# Altium schematic sheet master.SchDoc
size A4; SheetNumber: 1; SheetTotal: 1
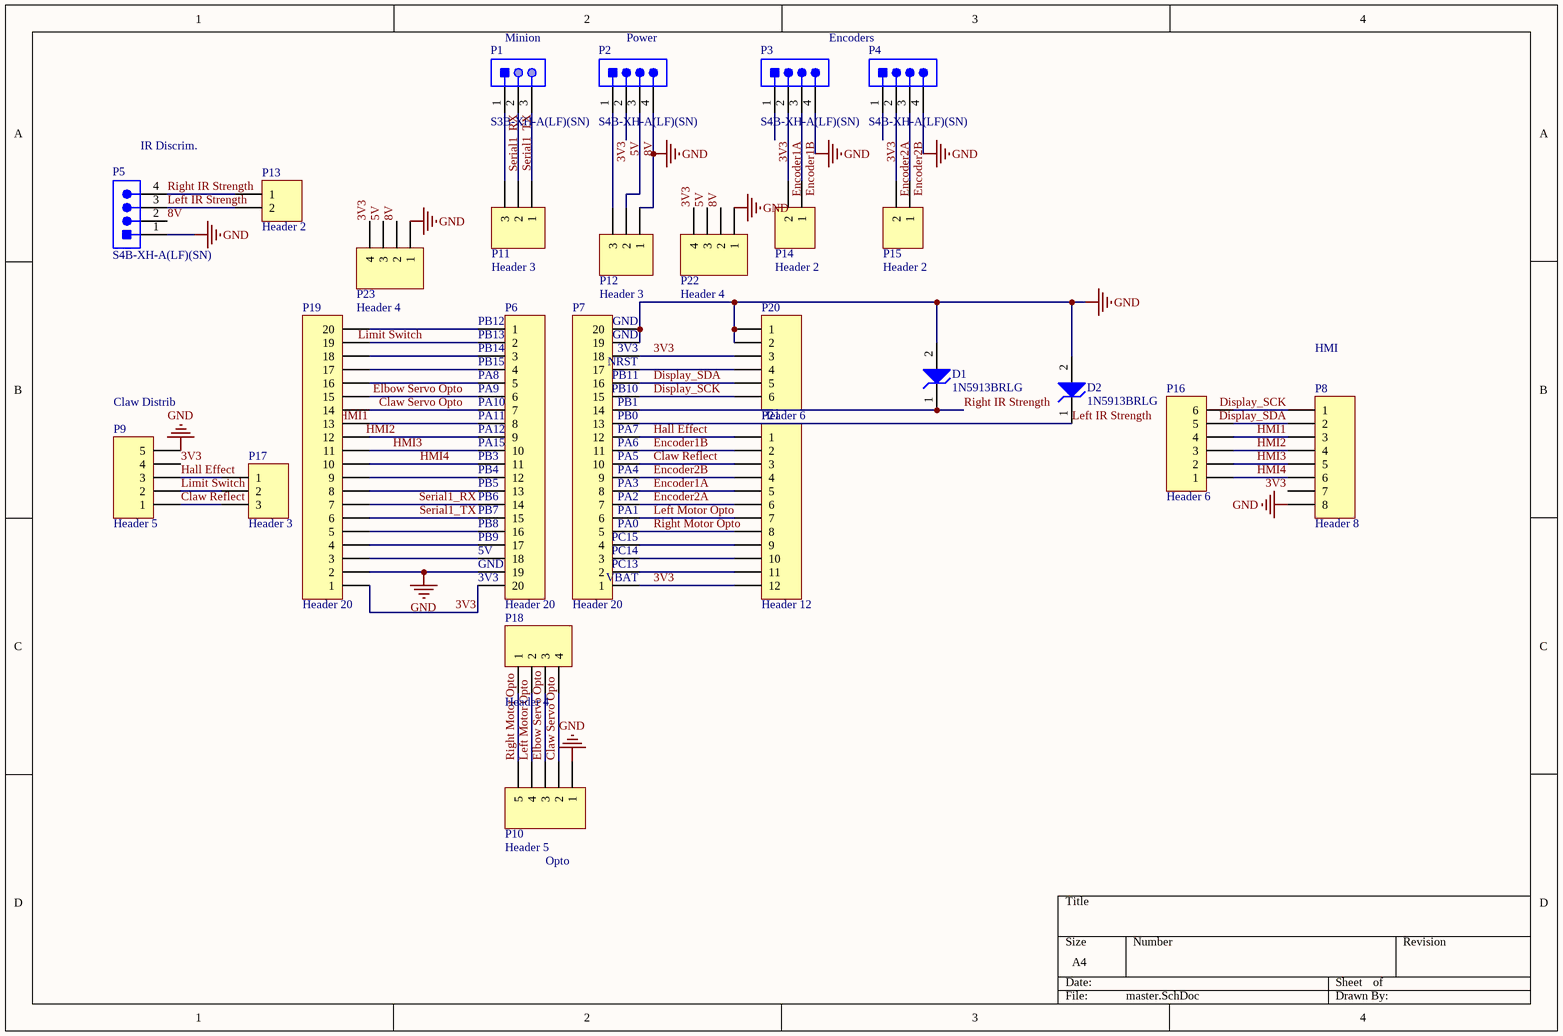
[diagram p0: master.SchDoc]

## Parts
D1  1N5913BRLG  [ONSC-AXIAL_LEAD-2-59-10_P]
D2  1N5913BRLG  [ONSC-AXIAL_LEAD-2-59-10_P]
P1  S3B-XH-A(LF)(SN)  [JST-S3B-XH-A(LF)(SN)_V]
P2  S4B-XH-A(LF)(SN)  [JST-S4B-XH-A(LF)(SN)_V]
P3  S4B-XH-A(LF)(SN)  [JST-S4B-XH-A(LF)(SN)_V]
P4  S4B-XH-A(LF)(SN)  [JST-S4B-XH-A(LF)(SN)_V]
P5  S4B-XH-A(LF)(SN)  [JST-S4B-XH-A(LF)(SN)_V]
P6  Header 20  [HDR1X20]
P7  Header 20  [HDR1X20]
P8  Header 8  [HDR1X8]
P9  Header 5  [HDR1X5]
P10  Header 5  [HDR1X5]
P11  Header 3  [HDR1X3]
P12  Header 3  [HDR1X3]
P13  Header 2  [HDR1X2]
P14  Header 2  [HDR1X2]
P15  Header 2  [HDR1X2]
P16  Header 6  [HDR1X6]
P17  Header 3  [HDR1X3]
P18  Header 4  [HDR1X4]
P19  Header 20  [HDR1X20]
P20  Header 6  [HDR1X6]
P21  Header 12  [HDR1X12]
P22  Header 4  [HDR1X4]
P23  Header 4  [HDR1X4]

## Nets
GND: D1.2(A) D2.2(A) P2.4 P3.4 P4.4 P5.1 P6.19 P7.19 P7.20 P8.8 P9.5 P10.1 P12.1 P19.2 P20.1 P20.2 P22.1 P23.1
3V3: P2.1 P3.1 P4.1 P6.20 P7.1 P7.18 P8.7 P9.4 P12.3 P19.1 P20.3 P21.12 P22.4 P23.4
5V: P2.2 P22.3 P23.3
8V: P2.3 P5.2 P12.2 P22.2 P23.2
Claw Reflect: P7.10 P9.1 P17.3 P21.3
Claw Servo Opto: P6.7 P10.2 P18.4 P19.14
Display_SCK: P7.15 P8.1 P16.6 P20.6
Display_SDA: P7.16 P8.2 P16.5 P20.5
Elbow Servo Opto: P6.6 P10.3 P18.3 P19.15
Encoder1A: P3.2 P7.8 P14.2 P21.5
Encoder1B: P3.3 P7.11 P14.1 P21.2
Encoder2A: P4.2 P7.7 P15.2 P21.6
Encoder2B: P4.3 P7.9 P15.1 P21.4
Hall Effect: P7.12 P9.3 P17.1 P21.1
HMI1: P6.8 P8.3 P16.4 P19.13
HMI2: P6.9 P8.4 P16.3 P19.12
HMI3: P6.10 P8.5 P16.2 P19.11
HMI4: P6.11 P8.6 P16.1 P19.10
Left IR Strength: D2.1(K) P5.3 P7.13 P13.2
Left Motor Opto: P7.6 P10.4 P18.2 P21.7
Limit Switch: P6.2 P9.2 P17.2 P19.19
Right IR Strength: D1.1(K) P5.4 P7.14 P13.1
Right Motor Opto: P7.5 P10.5 P18.1 P21.8
Serial1_RX: P1.1 P6.14 P11.3 P19.7
Serial1_TX: P1.2 P6.15 P11.2 P19.6
NetP1_3: P1.3 P11.1
NetP6_1: P6.1 P19.20
NetP6_3: P6.3 P19.18
NetP6_4: P6.4 P19.17
NetP6_5: P6.5 P19.16
NetP6_12: P6.12 P19.9
NetP6_13: P6.13 P19.8
NetP6_16: P6.16 P19.5
NetP6_17: P6.17 P19.4
NetP6_18: P6.18 P19.3
NetP7_2: P7.2 P21.11
NetP7_3: P7.3 P21.10
NetP7_4: P7.4 P21.9
NetP7_17: P7.17 P20.4

## Notes on the sheet
- (near P1) Minion
- (near P2) Power
- Encoders
- (near P5) IR Discrim.
- (near P6) PB12
- (near P6) PB13
- (near P6) PB14
- (near P6) PB15
- (near P6) PA8
- (near P7) PB11
- (near P7) NRST
- (near P7) GND
- (near P7) 3V3
- HMI
- (near P9) Claw Distrib
- (near P6) PA9
- (near P6) PA10
- (near P6) PA11
- (near P6) PA12
- (near P6) PA15
- (near P7) PA6
- (near P7) PA7
- (near P7) PB0
- (near P7) PB1
- (near P7) PB10
- (near P6) PB3
- (near P6) PB4
- (near P6) PB5
- (near P6) PB7
- (near P6) PB6
- (near P7) PA1
- (near P7) PA2
- (near P7) PA3
- (near P7) PA5
- (near P7) PA4
- (near P6) PB8
- (near P6) PB9
- (near P6) 5V
- (near P6) GND
- (near P6) 3V3
- (near P7) PC14
- (near P7) PC13
- (near P7) VBAT
- (near P7) PC15
- (near P7) PA0
- Opto

## Library data of the parts
D1 D2 = CMP-1060-00006-1: 3 W Zener Voltage Regulator, 2-Pin Axial_Lead, Pb-Free, Tape and Reel; Manufacturer: On Semiconductor; VZ Typ (V): 3.3; ComponentLink1URL: http://www.onsemi.com/; PartNumber: 1N5913BRLG; RoHS: Pb-Free; ComponentLink3URL: http://www.onsemi.cn/pub_link/Collateral/59-10.PDF; ComponentLink2Description: Datasheet; ComponentLink2URL: http://www.onsemi.cn/pub_link/Collateral/1N5913B-D.PDF; DatasheetVersion: Rev. 5; Packing: Tape and Reel; PackageReference: AXIAL_LEAD-2-59-10; ComponentLink3Description: Package Specification; PackageDescription: 2-Pin, Axial Lead, Diameter 2.35 mm; Mounting Technology: Through Hole; ComponentLink1Description: Manufacturer URL; PackageVersion: Rev. U, 02/2005
P1 = CMP-1755-00006-1: Male Header, Pitch 2.5 mm, 1 x 3 Position, Height 6.1 mm, Tail Length 3.4 mm, -25 to 85 degC, RoHS, Bulk; Min Supply Voltage: 1 V; Frequency: 1.8 MHz; Channels: 1; Nominal Supply Current: 170 uA; Max Power Dissipation: 1 W; Max Ouput Current: -10 mA; Case\Package: DIP; Max Supply Voltage: 15 V; Min Operating Temperature: 0 degC; Weight: 0.015535 oz; Radiation Hardening: No; ComponentLink1URL: http://www.jst.com/home2.html; PackageReference: S3B-XH-A(LF)(SN); Length: 9.81 mm; Max Operating Temperature: 70 degC; Package Quantity: 50; REACH SVHC: No SVHC; Mount: Through Hole; Pins: 8; Height: 4.57 mm; DatasheetVersion: May-16; ComponentLink1Description: Manufacturer URL; PackageDescription: Male Header, Pitch 2.5 mm, 1 x 3 Position, Height 6.1 mm, Tail Length 3.4 mm; RoHSCompliant: true; Packaging: Rail/Tube; Width: 6.35 mm; ComponentLink2URL: http://www.jst-mfg.com/product/pdf/eng/eXH.pdf; ComponentLink2Description: Datasheet
P2-P5 = CMP-1755-00007-1: Male Header, Pitch 2.5 mm, 1 x 4 Position, Height 6.1 mm, Tail Length 3.4 mm, -25 to 85 degC, RoHS, Bulk; PackageReference: S4B-XH-A(LF)(SN); ComponentLink1Description: Manufacturer URL; DatasheetVersion: May-16; ComponentLink2Description: Datasheet; ComponentLink2URL: http://www.jst-mfg.com/product/pdf/eng/eXH.pdf; ComponentLink1URL: http://www.jst.com/home2.html; PackageDescription: Male Header, Pitch 2.5 mm, 1 x 4 Position, Height 6.1 mm, Tail Length 3.4 mm
P6 P7 P19 = Header 20: Header, 20-Pin; LatestRevisionDate: 17-Jul-2002; LatestRevisionNote: Re-released for DXP Platform.; Publisher: Altium Limited
P8 = Header 8: Header, 8-Pin; LatestRevisionDate: 17-Jul-2002; LatestRevisionNote: Re-released for DXP Platform.; Publisher: Altium Limited
P9 P10 = Header 5: Header, 5-Pin; LatestRevisionDate: 17-Jul-2002; LatestRevisionNote: Re-released for DXP Platform.; Publisher: Altium Limited
P11 P12 P17 = Header 3: Header, 3-Pin; LatestRevisionDate: 17-Jul-2002; LatestRevisionNote: Re-released for DXP Platform.; Publisher: Altium Limited
P13-P15 = Header 2: Header, 2-Pin; LatestRevisionDate: 17-Jul-2002; LatestRevisionNote: Re-released for DXP Platform.; Publisher: Altium Limited
P16 P20 = Header 6: Header, 6-Pin; LatestRevisionDate: 17-Jul-2002; LatestRevisionNote: Re-released for DXP Platform.; Publisher: Altium Limited
P18 P22 P23 = Header 4: Header, 4-Pin; LatestRevisionDate: 17-Jul-2002; LatestRevisionNote: Re-released for DXP Platform.; Publisher: Altium Limited
P21 = Header 12: Header, 12-Pin; LatestRevisionDate: 17-Jul-2002; LatestRevisionNote: Re-released for DXP Platform.; Publisher: Altium Limited